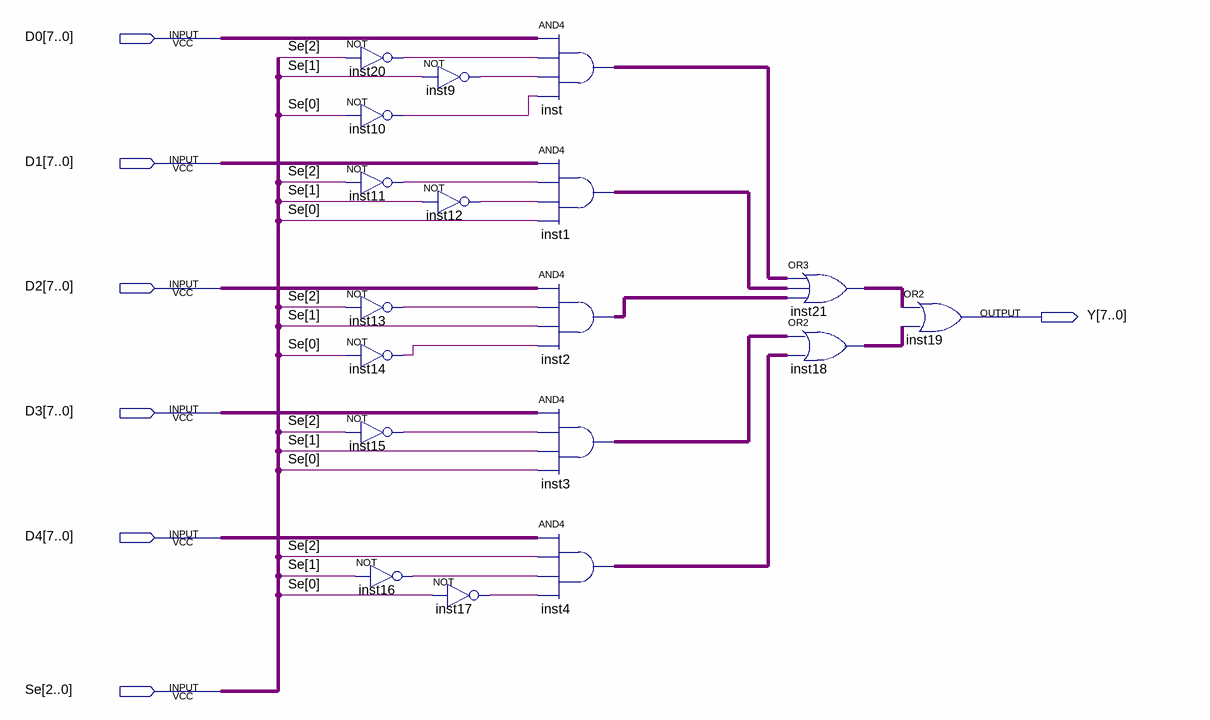
[diagram p0: schematic sheet]
// Quartus schematic 8mux51.bdf as structural Verilog: 18 symbols, 7 pins
module \8mux51  (
  input  [7:0] D0,
  input  [7:0] D1,
  input  [7:0] D2,
  input  [7:0] D3,
  input  [7:0] D4,
  input  [2:0] Se,
  output [7:0] Y
);

  wire inst9_out, inst10_out, inst11_out, inst12_out, inst13_out, inst14_out, inst15_out, inst16_out,
       inst17_out, inst20_out;
  wire [7:0] inst1_out, inst2_out, inst3_out, inst4_out, inst18_out, inst21_out, inst_out;

  not inst20 (inst20_out, Se[2]);
  not inst10 (inst10_out, Se[0]);
  not inst11 (inst11_out, Se[2]);
  not inst13 (inst13_out, Se[2]);
  not inst14 (inst14_out, Se[0]);
  not inst15 (inst15_out, Se[2]);
  not inst16 (inst16_out, Se[1]);
  not inst9 (inst9_out, Se[1]);
  not inst12 (inst12_out, Se[1]);
  not inst17 (inst17_out, Se[0]);
  assign inst_out = D0 & {8{inst20_out}} & {8{inst9_out}} & {8{inst10_out}};  // AND4 inst, 8 bits wide
  assign inst1_out = D1 & {8{inst11_out}} & {8{inst12_out}} & {8{Se[0]}};  // AND4 inst1, 8 bits wide
  assign inst2_out = D2 & {8{inst13_out}} & {8{Se[1]}} & {8{inst14_out}};  // AND4 inst2, 8 bits wide
  assign inst3_out = D3 & {8{inst15_out}} & {8{Se[1]}} & {8{Se[0]}};  // AND4 inst3, 8 bits wide
  assign inst4_out = D4 & {8{Se[2]}} & {8{inst16_out}} & {8{inst17_out}};  // AND4 inst4, 8 bits wide
  assign inst21_out = inst_out | inst1_out | inst2_out;  // OR3 inst21, 8 bits wide
  assign inst18_out = inst3_out | inst4_out;  // OR2 inst18, 8 bits wide
  assign Y = inst21_out | inst18_out;  // OR2 inst19, 8 bits wide
endmodule
